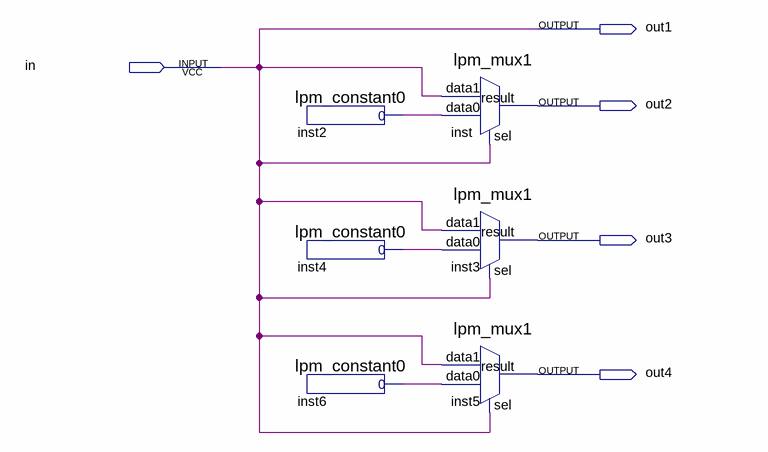
[diagram p0: schematic sheet]
// Quartus schematic 1to4.bdf as structural Verilog: 6 symbols, 5 pins
module \1to4  (
  input  in,
  output out1,
  output out2,
  output out3,
  output out4
);

  wire inst2_result, inst4_result, inst6_result;

  lpm_constant0 inst2 (.result(inst2_result));
  lpm_constant0 inst4 (.result(inst4_result));
  lpm_constant0 inst6 (.result(inst6_result));
  lpm_mux1 inst (.data1(in), .data0(inst2_result), .sel(in), .result(out2));
  lpm_mux1 inst3 (.data1(in), .data0(inst4_result), .sel(in), .result(out3));
  lpm_mux1 inst5 (.data1(in), .data0(inst6_result), .sel(in), .result(out4));

  assign out1 = in;
endmodule
